# EasyEDA Pro project Sensor_colis_examples.epro, board 2024-06-03_06-19-02
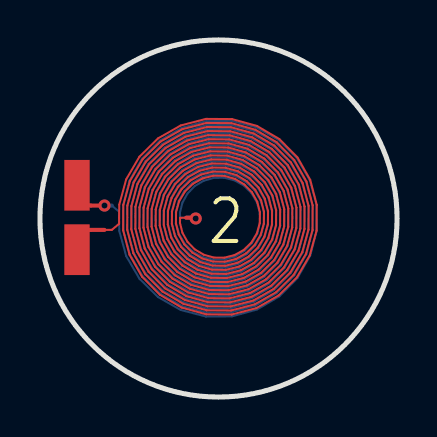
[diagram p2: board, top side]
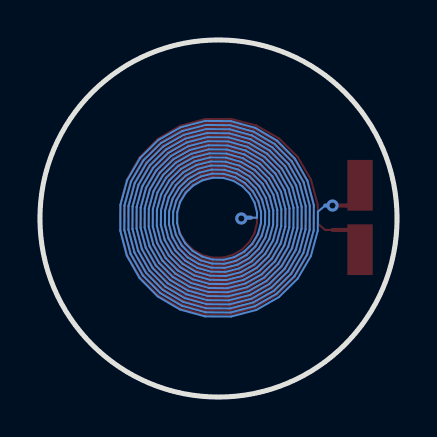
[diagram p3: board, bottom side, seen from below]

Outline 17.88 x 17.88 mm; copper layers: Top Layer, Bottom Layer. Coordinates in mm from the lower left corner of the outline.
Outline path: circle c8.94,8.94 r8.94
Stack: Top Layer 0.035mm - / Dielectric1 1.51mm FR4 er 4.5 / Bottom Layer 0.035mm -

## Design rules (mm)
template: 用户自定义配置
spacing safeClearance (default): track to track 0.152, other pairs 0.152 to 0.3
track width trackWidth (default): min 0.025, default 0.254, max 2.54
differential pair differentialPair (default): width min 0.127, default 0.254, max 2.54; gap min 0.152, default 0.152
via viaSize (default): diameter min 0.5, default 0.61, max 10; hole min 0.3, default 0.305, max 5.999

## Placement (name value [footprint] x y rotation side)
CSENSOR  -  [0402]  1.86 9.07 90 top

## Footprints (pads in the part's own frame, mm; a bottom-side part is the same pattern mirrored in y, then rotated)
0402
  rect 2.54x1.27 smd: 1(-1.689,0) 2(1.536,0)

## Nets
3: CSENSOR.1 CSENSOR.2

## Via types
v1: diameter 0.61, hole 0.305, Top Layer to Bottom Layer, 2 vias

## Routing (per net, layer and track width the routed paths; a pad name or vN(x,y) marks a point on that pad's centre or on a via; arc(x,y) is an arc through that point)
3: length 664.4
  Top Layer w0.102: 3.23,8.37 3.6,8.37 3.96,8.68 3.96,8.98 3.97,9.64 4.32,10.9 4.98,12.03 5.91,12.95 7.05,13.6 8.31,13.93 9.61,13.92 10.87,13.58 11.99,12.92 12.9,12 13.53,10.87 13.86,9.63 13.85,8.34 13.51,7.1 12.86,5.99 11.95,5.09 10.84,4.46 9.6,4.13 8.33,4.14 7.1,4.48 6,5.12 5.11,6.03 4.49,7.13 4.17,8.35 4.17,9.61 4.51,10.83 5.14,11.91 6.04,12.79 7.13,13.41 8.34,13.73 9.59,13.72 10.79,13.39 11.86,12.76 12.73,11.87 13.35,10.8 13.66,9.6 13.65,8.36 13.32,7.18 12.7,6.11 11.82,5.25 10.76,4.65 9.57,4.34 8.35,4.35 7.18,4.67 6.13,5.28 5.27,6.15 4.67,7.2 4.37,8.38 4.38,9.58 4.7,10.75 5.31,11.79 6.16,12.63 7.21,13.22 8.36,13.52 9.56,13.51 10.71,13.2 11.74,12.6 12.57,11.75 13.16,10.72 13.45,9.57 13.45,8.39 13.13,7.25 12.54,6.24 11.7,5.41 10.68,4.83 9.55,4.54 8.38,4.55 7.26,4.86 6.25,5.45 5.44,6.27 4.86,7.28 4.57,8.4 4.58,9.56 4.89,10.67 5.47,11.66 6.29,12.47 7.28,13.03 8.39,13.32 9.53,13.31 10.63,13.01 11.61,12.43 12.41,11.62 12.97,10.64 13.25,9.55 13.24,8.42 12.94,7.33 12.37,6.36 11.58,5.58 10.6,5.02 9.52,4.74 8.41,4.75 7.33,5.05 6.38,5.61 5.6,6.4 5.05,7.36 4.78,8.43 4.78,9.53 5.08,10.59 5.63,11.54 6.41,12.3 7.36,12.84 8.42,13.12 9.51,13.11 10.55,12.82 11.49,12.27 12.25,11.5 12.78,10.56 13.05,9.52 13.04,8.44 12.75,7.41 12.21,6.49 11.45,5.74 10.52,5.21 9.49,4.95 8.43,4.95 7.41,5.24 6.5,5.77 5.76,6.52 5.24,7.44 4.98,8.46 4.99,9.5 5.27,10.51 5.8,11.41 6.54,12.14 7.44,12.65 8.44,12.91 9.48,12.9 10.47,12.63 11.36,12.11 12.08,11.37 12.59,10.48 12.84,9.49 12.84,8.47 12.56,7.49 12.05,6.61 11.33,5.9 10.44,5.4 9.47,5.15 8.46,5.16 7.49,5.43 6.63,5.94 5.92,6.65 5.43,7.52 5.18,8.48 5.19,9.48 5.46,10.43 5.96,11.29 6.66,11.98 7.52,12.46 8.47,12.71 9.45,12.7 10.4,12.44 11.24,11.94 11.92,11.25 12.4,10.4 12.64,9.47 12.63,8.5 12.37,7.57 11.89,6.74 11.2,6.06 10.37,5.59 9.44,5.35 8.49,5.36 7.57,5.62 6.75,6.1 6.09,6.77 5.62,7.6 5.39,8.51 5.39,9.45 5.65,10.35 6.12,11.16 6.79,11.82 7.6,12.27 8.5,12.51 9.43,12.5 10.32,12.25 11.11,11.78 11.76,11.13 12.21,10.33 12.44,9.44 12.43,8.52 12.19,7.65 11.72,6.86 11.08,6.23 10.29,5.78 9.41,5.56 8.51,5.56 7.65,5.81 6.88,6.26 6.25,6.9 5.81,7.68 5.59,8.54 5.6,9.42 5.83,10.28 6.28,11.04 6.91,11.65 7.68,12.09 8.53,12.3 9.4,12.3 10.24,12.06 10.99,11.62 11.59,11 12.02,10.25 12.24,9.41 12.23,8.55 12,7.72 11.56,6.99 10.95,6.39 10.21,5.97 9.39,5.76 8.54,5.77 7.73,5.99 7,6.42 6.41,7.02 6,7.75 5.79,8.56 5.8,9.4 6.02,10.2 6.45,10.91 7.04,11.49 7.76,11.9 8.55,12.1 9.37,12.09 10.16,11.87 10.86,11.46 11.43,10.88 11.83,10.17 12.03,9.38 12.02,8.58 11.81,7.8 11.4,7.11 10.83,6.55 10.13,6.16 9.36,5.96 8.57,5.97 7.8,6.18 7.12,6.59 6.57,7.15 6.19,7.83 6,8.59 6,9.37 6.21,10.12 6.61,10.79 7.16,11.33 7.83,11.71 8.58,11.9 9.35,11.89 10.08,11.68 10.74,11.29 11.27,10.75 11.64,10.09 11.83,9.36 11.82,8.6 11.62,7.88 11.24,7.24 10.7,6.71 10.05,6.35 9.33,6.17 8.59,6.17 7.88,6.37 7.25,6.75 6.74,7.27 6.38,7.91 6.2,8.62 6.21,9.34 6.4,10.04 6.77,10.66 7.29,11.17 7.91,11.52 8.61,11.69 9.32,11.69 10,11.49 10.61,11.13 11.11,10.63 11.45,10.01 11.63,9.33 11.62,8.63 11.43,7.96 11.07,7.36 10.58,6.88 9.97,6.54 9.31,6.37 8.62,6.38 7.96,6.56 7.37,6.91 6.9,7.4 6.57,7.99 6.4,8.64 6.41,9.32 6.59,9.96 6.93,10.54 7.41,11 7.99,11.33 8.63,11.49 9.29,11.48 9.93,11.3 10.49,10.97 10.94,10.5 11.26,9.93 11.42,9.3 11.41,8.66 11.24,8.04 10.91,7.49 10.45,7.04 9.9,6.73 9.28,6.57 8.65,6.58 8.04,6.75 7.5,7.07 7.06,7.52 6.76,8.07 6.6,8.67 6.61,9.29 6.78,9.88 7.1,10.41 7.54,10.84 8.07,11.14 8.66,11.29 9.27,11.28 9.85,11.11 10.36,10.81 10.78,10.38 11.07,9.85 11.22,9.28 11.21,8.68 11.05,8.12 10.75,7.61 10.33,7.2 9.82,6.92 9.25,6.78 8.67,6.78 8.12,6.94 7.62,7.24 7.22,7.65 6.95,8.15 6.81,8.7 6.82,9.26 6.97,9.81 7.26,10.29 7.66,10.68 8.15,10.95 8.69,11.08 9.24,11.08 9.77,10.93 10.24,10.64 10.62,10.25 10.88,9.78 11.02,9.25 11.01,8.71 10.86,8.19 10.59,7.74 10.2,7.36 9.74,7.11 9.23,6.98 8.7,6.99 8.2,7.13 7.75,7.4 7.39,7.77 7.14,8.22 7.01,8.72 7.02,8.98 7.32,8.98
  Top Layer w0.203: 1.87,8.37 3.23,8.37 ; 1.87,9.77 1.87,9.68 2.55,9.59 v1(3.23,9.59) ; 7.32,8.98 7.62,8.98
  Bottom Layer w0.102: 7.32,8.98 7.02,8.98 7.01,9.24 7.14,9.74 7.39,10.19 7.75,10.56 8.2,10.83 8.7,10.97 9.23,10.98 9.74,10.85 10.2,10.6 10.59,10.23 10.86,9.77 11.01,9.25 11.02,8.71 10.88,8.18 10.62,7.71 10.24,7.32 9.77,7.04 9.24,6.89 8.69,6.88 8.15,7.01 7.66,7.28 7.26,7.67 6.97,8.16 6.82,8.7 6.81,9.26 6.95,9.82 7.22,10.31 7.62,10.73 8.12,11.02 8.67,11.18 9.25,11.19 9.82,11.04 10.33,10.76 10.75,10.35 11.05,9.85 11.21,9.28 11.22,8.68 11.07,8.11 10.78,7.58 10.36,7.15 9.85,6.85 9.27,6.68 8.66,6.67 8.07,6.82 7.54,7.12 7.1,7.55 6.78,8.08 6.61,8.67 6.6,9.29 6.76,9.89 7.06,10.44 7.5,10.89 8.04,11.21 8.65,11.38 9.28,11.39 9.9,11.23 10.45,10.92 10.91,10.48 11.24,9.92 11.41,9.3 11.42,8.66 11.26,8.03 10.94,7.46 10.49,6.99 9.93,6.66 9.29,6.48 8.63,6.47 7.99,6.63 7.41,6.96 6.93,7.42 6.59,8 6.41,8.64 6.4,9.32 6.57,9.97 6.9,10.56 7.37,11.05 7.96,11.4 8.62,11.58 9.31,11.59 9.97,11.42 10.58,11.08 11.07,10.6 11.43,10 11.62,9.33 11.63,8.63 11.45,7.95 11.11,7.34 10.61,6.83 10,6.47 9.32,6.28 8.61,6.27 7.91,6.44 7.29,6.8 6.77,7.3 6.4,7.92 6.21,8.62 6.2,9.34 6.38,10.05 6.74,10.69 7.25,11.21 7.88,11.59 8.59,11.79 9.33,11.8 10.05,11.61 10.7,11.25 11.24,10.72 11.62,10.08 11.82,9.36 11.83,8.6 11.64,7.87 11.27,7.21 10.74,6.67 10.08,6.28 9.35,6.07 8.58,6.06 7.83,6.25 7.16,6.63 6.61,7.17 6.21,7.84 6,8.59 6,9.37 6.19,10.13 6.57,10.81 7.12,11.38 7.8,11.78 8.57,11.99 9.36,12 10.13,11.8 10.83,11.41 11.4,10.85 11.81,10.16 12.02,9.38 12.03,8.58 11.83,7.79 11.43,7.09 10.86,6.5 10.16,6.09 9.37,5.87 8.55,5.86 7.76,6.07 7.04,6.47 6.45,7.05 6.02,7.76 5.8,8.56 5.79,9.4 6,10.21 6.41,10.94 7,11.54 7.73,11.97 8.54,12.19 9.39,12.2 10.21,11.99 10.95,11.57 11.56,10.97 12,10.24 12.23,9.41 12.24,8.55 12.02,7.71 11.59,6.96 10.99,6.34 10.24,5.9 9.4,5.67 8.53,5.66 7.68,5.88 6.91,6.31 6.28,6.92 5.83,7.68 5.6,8.54 5.59,9.42 5.81,10.29 6.25,11.06 6.88,11.7 7.65,12.16 8.51,12.4 9.41,12.41 10.29,12.18 11.08,11.73 11.72,11.1 12.19,10.32 12.43,9.44 12.44,8.52 12.21,7.64 11.76,6.84 11.11,6.18 10.32,5.71 9.43,5.46 8.5,5.45 7.6,5.69 6.79,6.15 6.12,6.8 5.65,7.61 5.39,8.51 5.39,9.45 5.62,10.36 6.09,11.19 6.75,11.86 7.57,12.35 8.49,12.6 9.44,12.61 10.37,12.37 11.2,11.9 11.89,11.22 12.37,10.39 12.63,9.46 12.64,8.5 12.4,7.56 11.92,6.71 11.24,6.02 10.4,5.52 9.45,5.26 8.47,5.25 7.52,5.5 6.66,5.98 5.96,6.68 5.46,7.53 5.19,8.48 5.18,9.48 5.43,10.44 5.92,11.31 6.63,12.03 7.49,12.53 8.46,12.8 9.47,12.81 10.44,12.56 11.33,12.06 12.05,11.35 12.56,10.47 12.84,9.49 12.84,8.47 12.59,7.48 12.08,6.59 11.36,5.85 10.47,5.33 9.48,5.06 8.44,5.05 7.44,5.31 6.54,5.82 5.8,6.55 5.27,7.45 4.99,8.46 4.98,9.51 5.24,10.52 5.76,11.44 6.5,12.19 7.41,12.72 8.43,13.01 9.49,13.02 10.52,12.75 11.45,12.22 12.21,11.47 12.75,10.55 13.04,9.52 13.05,8.44 12.78,7.4 12.25,6.46 11.49,5.69 10.55,5.14 9.51,4.85 8.42,4.84 7.36,5.12 6.41,5.66 5.63,6.43 5.08,7.37 4.78,8.43 4.78,9.53 5.05,10.6 5.6,11.56 6.38,12.35 7.33,12.91 8.41,13.21 9.52,13.22 10.6,12.94 11.58,12.39 12.37,11.6 12.94,10.63 13.24,9.54 13.25,8.42 12.97,7.32 12.41,6.34 11.61,5.53 10.63,4.95 9.53,4.65 8.39,4.64 7.28,4.93 6.29,5.49 5.47,6.3 4.89,7.29 4.58,8.4 4.57,9.56 4.86,10.68 5.44,11.69 6.25,12.51 7.26,13.1 8.38,13.41 9.55,13.42 10.68,13.13 11.7,12.55 12.54,11.72 13.13,10.71 13.45,9.57 13.45,8.39 13.16,7.24 12.57,6.21 11.74,5.37 10.71,4.76 9.56,4.45 8.36,4.44 7.21,4.74 6.16,5.33 5.31,6.18 4.7,7.21 4.38,8.38 4.37,9.59 4.67,10.76 5.27,11.81 6.13,12.68 7.18,13.29 8.35,13.62 9.57,13.62 10.76,13.32 11.82,12.71 12.7,11.85 13.32,10.79 13.65,9.6 13.66,8.36 13.35,7.17 12.73,6.09 11.86,5.2 10.79,4.57 9.59,4.24 8.34,4.24 7.13,4.55 6.04,5.17 5.14,6.05 4.51,7.14 4.17,8.35 4.17,9.61 4.49,10.84 5.11,11.94 6,12.84 7.1,13.48 8.33,13.82 9.6,13.83 10.84,13.51 11.95,12.87 12.86,11.97 13.51,10.86 13.85,9.62 13.86,8.34 13.53,7.09 12.9,5.96 11.99,5.04 10.87,4.38 9.61,4.04 8.31,4.03 7.05,4.36 5.91,5.01 4.98,5.93 4.32,7.06 3.97,8.32 3.96,8.98 3.96,9.29 3.6,9.59
  Bottom Layer w0.203: 7.32,8.98 7.62,8.98 ; 3.6,9.59 v1(3.23,9.59)
  vias: v1(7.8,8.94)

## Text on the board
Top Silkscreen Layer: Layers = 2 | Turns = 15 | Version - 1.1 | -------------- | Design Id - 104 | Coil Parameters | Customized for LDC1612 | Trace Width = 4.0 mils | Layer Stack Information | Trace Spacing = 4.0 mils | ------------------------- | WEBENCH Design Information | Copper thickness = 1.0 Oz-Cu | Exported on - 2024/06/03 06:18:59 | Inner Diameter = 154 mils (Approx.) | Outer Diameter = 394 mils (Approx.) | Space between TOP and BOTTOM = 4.0 mils | Exported from WEBENCH Coil Designer Tool | 2
